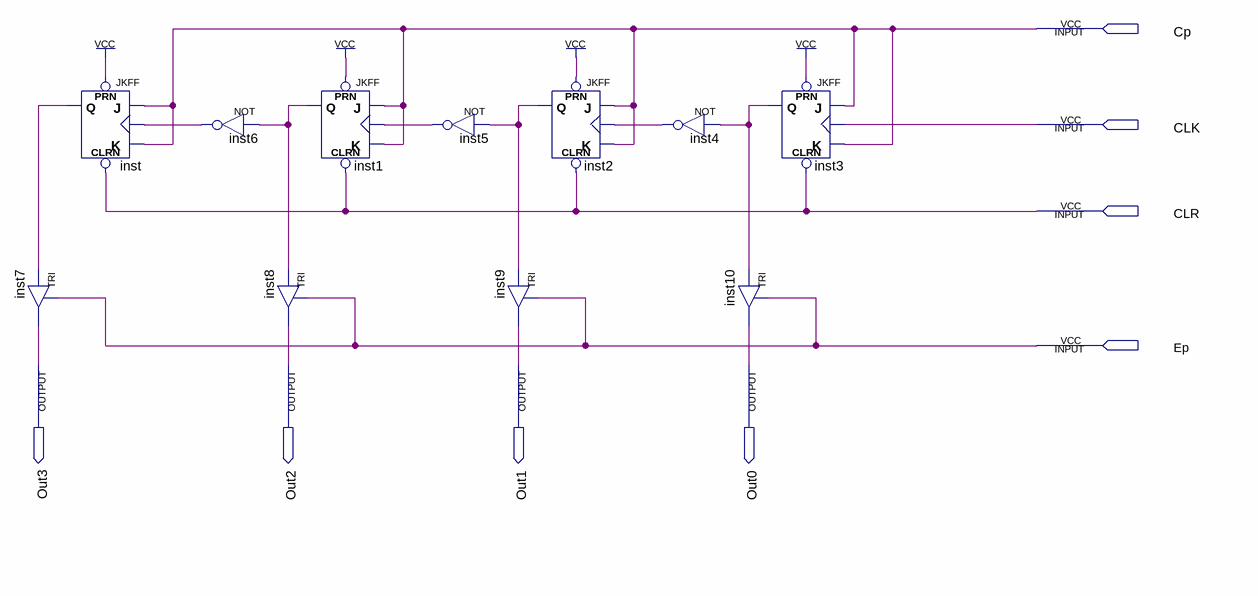
[diagram p0: schematic sheet]
// Quartus schematic ContadorDeProgramas.bdf as structural Verilog: 11 symbols, 8 pins
module ContadorDeProgramas (
  input  Cp,
  input  CLK,
  input  CLR,
  input  Ep,
  output Out3,
  output Out2,
  output Out1,
  output Out0
);

  wire inst1_q, inst2_q, inst3_q, inst4_out, inst5_out, inst6_out, inst_q;

  TRI inst7 (.IN(inst_q), .OE(Ep), .OUT(Out3));
  JKFF inst (.PRN(1'b1), .CLRN(CLR), .K(Cp), .J(Cp), .CLK(inst6_out), .Q(inst_q));
  not inst6 (inst6_out, inst1_q);
  JKFF inst1 (.PRN(1'b1), .CLRN(CLR), .K(Cp), .J(Cp), .CLK(inst5_out), .Q(inst1_q));
  TRI inst8 (.IN(inst1_q), .OE(Ep), .OUT(Out2));
  not inst5 (inst5_out, inst2_q);
  JKFF inst2 (.PRN(1'b1), .CLRN(CLR), .K(Cp), .J(Cp), .CLK(inst4_out), .Q(inst2_q));
  TRI inst9 (.IN(inst2_q), .OE(Ep), .OUT(Out1));
  not inst4 (inst4_out, inst3_q);
  JKFF inst3 (.PRN(1'b1), .CLRN(CLR), .K(Cp), .J(Cp), .CLK(CLK), .Q(inst3_q));
  TRI inst10 (.IN(inst3_q), .OE(Ep), .OUT(Out0));
endmodule
